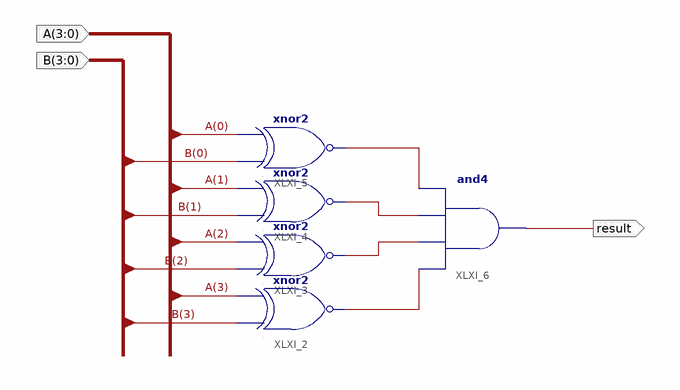
[diagram p0: schematic sheet 1]
// Xilinx ISE schematic equals.sch (xc9500xl) as structural Verilog: 5 symbols, 3 ports
module equals (
  input  [3:0] A,
  input  [3:0] B,
  output result
);

  wire XLXN_1, XLXN_2, XLXN_3, XLXN_4;

  xnor XLXI_2 (XLXN_4, B[3], A[3]);
  xnor XLXI_3 (XLXN_3, B[2], A[2]);
  xnor XLXI_4 (XLXN_2, B[1], A[1]);
  xnor XLXI_5 (XLXN_1, B[0], A[0]);
  and XLXI_6 (result, XLXN_4, XLXN_3, XLXN_2, XLXN_1);
endmodule
